# Altium schematic sheet Shoot-Me-Bot.SchDoc
size 863 x 558 mm
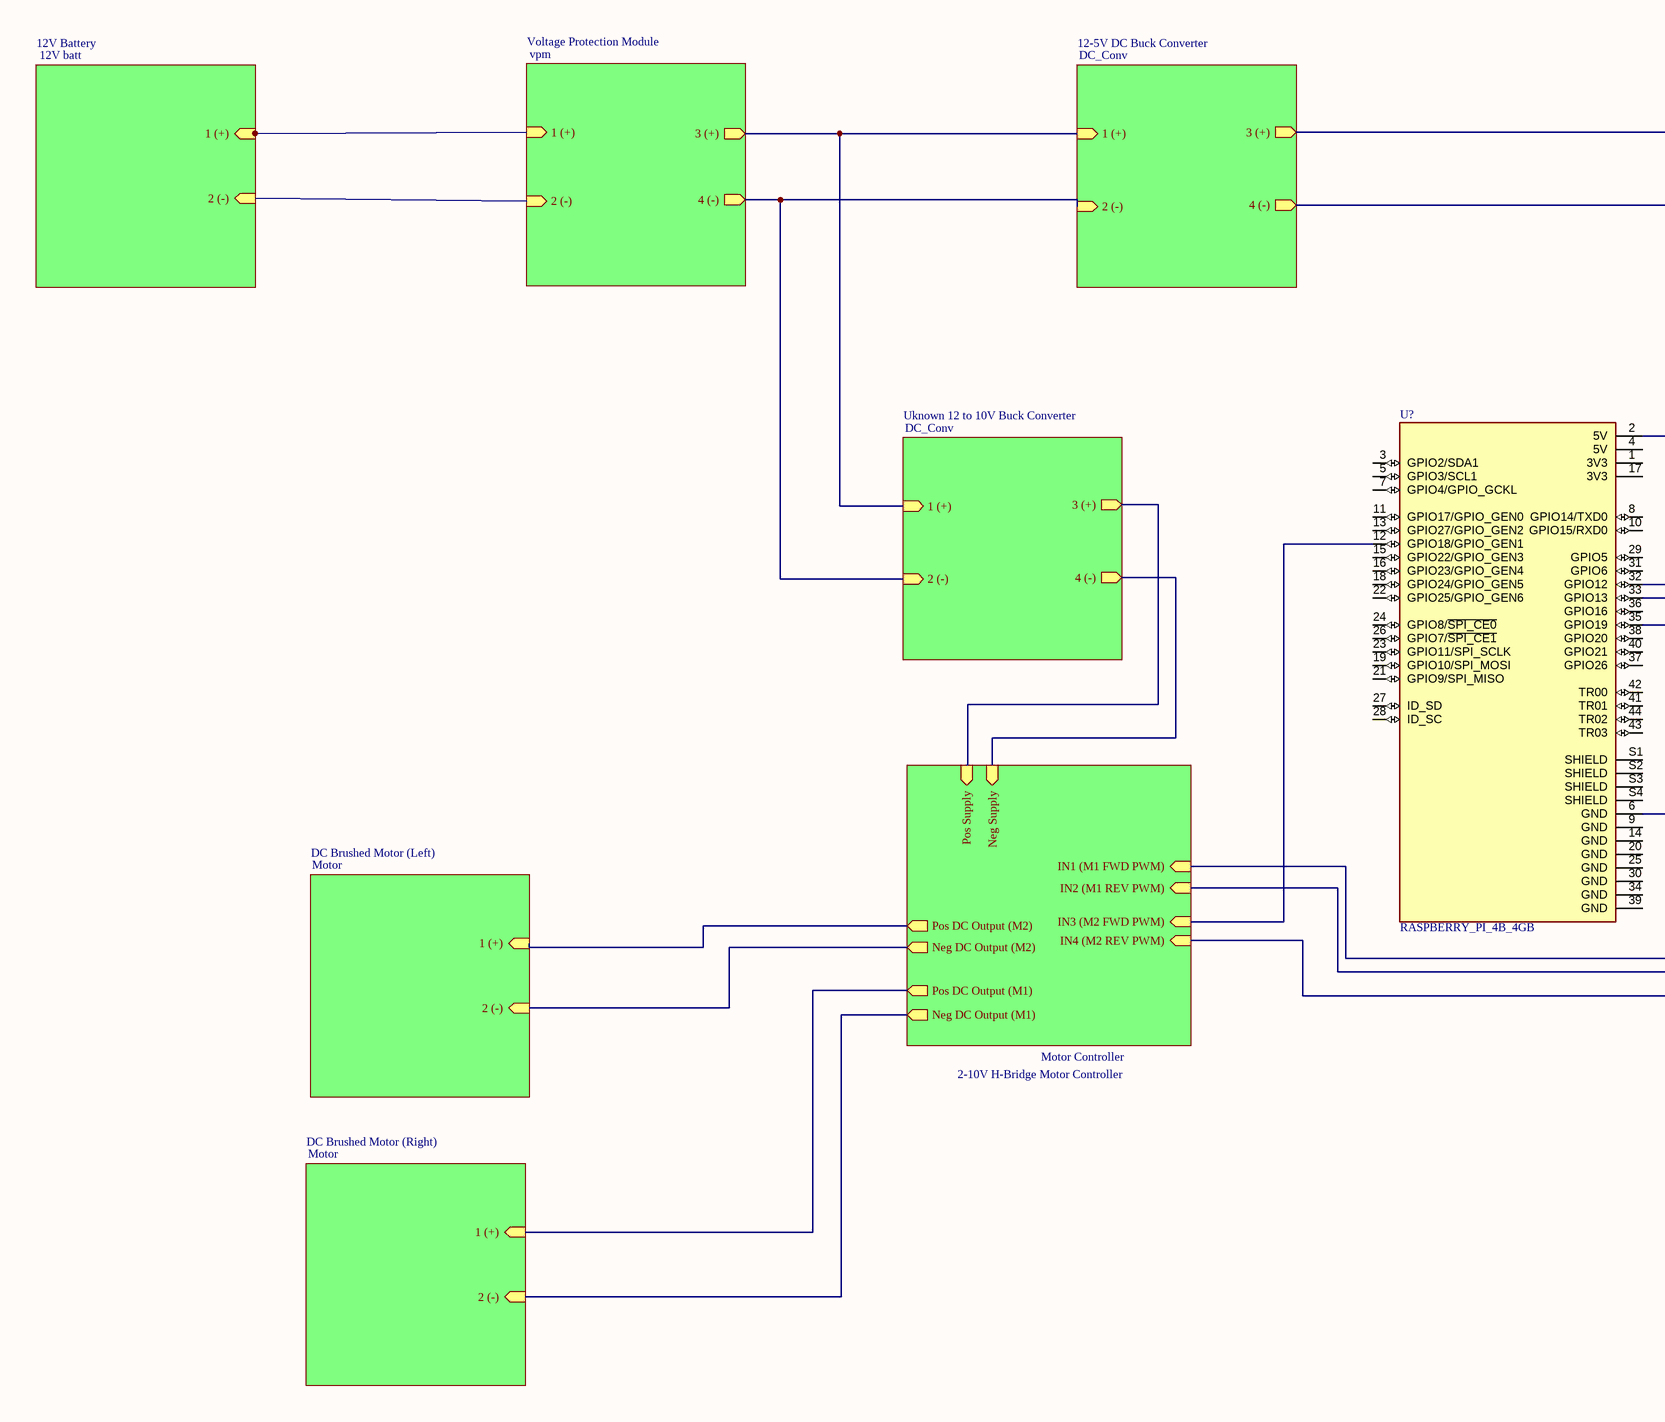
[diagram p0: Shoot-Me-Bot.SchDoc, left]
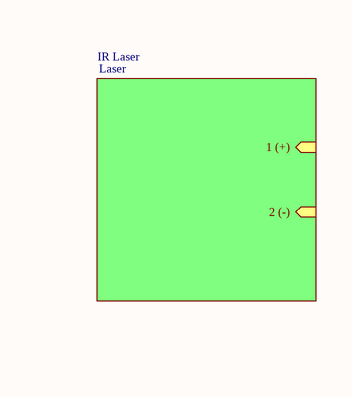
[diagram p1: Shoot-Me-Bot.SchDoc, right]

## Parts
U?  RASPBERRY_PI_4B_4GB  [MODULE_RASPBERRY_PI_4B_4GB]

## Sub-sheets
2-10V H-Bridge Motor Controller = Motor Controller: IN1 (M1 FWD PWM) (in), IN2 (M1 REV PWM) (in), IN3 (M2 FWD PWM) (in), IN4 (M2 REV PWM) (in), Pos DC Output (M1) (out), Neg DC Output (M1) (out), Pos DC Output (M2) (out), Neg DC Output (M2) (out), Pos Supply (in), Neg Supply (in)
12-5V DC Buck Converter = DC_Conv: 2 (-) (in), 1 (+) (in), 3 (+) (out), 4 (-) (out)
12V Battery = 12V batt: 2 (-) (in), 1 (+) (in)
DC Brushed Motor (Left) = Motor: 2 (-) (in), 1 (+) (in)
DC Brushed Motor (Right) = Motor: 2 (-) (in), 1 (+) (in)
IR Laser = Laser: 2 (-) (in), 1 (+) (in)
Uknown 12 to 10V Buck Converter = DC_Conv: 2 (-) (in), 1 (+) (in), 3 (+) (out), 4 (-) (out)
Voltage Protection Module = vpm: 2 (-) (in), 3 (+) (out), 1 (+) (in), 4 (-) (out)

## Nets
NetU?_2: U?.2(5V) ; sheet 12-5V DC Buck Converter/3 (+)
NetU?_6: U?.6(GND) ; sheet 12-5V DC Buck Converter/4 (-)
NetU?_12: U?.12(GPIO18/GPIO_GEN1) ; sheet 2-10V H-Bridge Motor Controller/IN3 (M2 FWD PWM)
NetU?_32: U?.32(GPIO12) ; sheet 2-10V H-Bridge Motor Controller/IN1 (M1 FWD PWM)
NetU?_33: U?.33(GPIO13) ; sheet 2-10V H-Bridge Motor Controller/IN2 (M1 REV PWM)
NetU?_35: U?.35(GPIO19) ; sheet 2-10V H-Bridge Motor Controller/IN4 (M2 REV PWM)
(unnamed): sheet Voltage Protection Module/2 (-), sheet 12V Battery/2 (-)
(unnamed): sheet Voltage Protection Module/3 (+), sheet 12-5V DC Buck Converter/1 (+), sheet Uknown 12 to 10V Buck Converter/1 (+)
(unnamed): sheet Voltage Protection Module/1 (+), sheet 12V Battery/1 (+)
(unnamed): sheet Voltage Protection Module/4 (-), sheet 12-5V DC Buck Converter/2 (-), sheet Uknown 12 to 10V Buck Converter/2 (-)
(unnamed): sheet DC Brushed Motor (Left)/2 (-), sheet 2-10V H-Bridge Motor Controller/Neg DC Output (M2)
(unnamed): sheet DC Brushed Motor (Left)/1 (+), sheet 2-10V H-Bridge Motor Controller/Pos DC Output (M2)
(unnamed): sheet DC Brushed Motor (Right)/2 (-), sheet 2-10V H-Bridge Motor Controller/Neg DC Output (M1)
(unnamed): sheet DC Brushed Motor (Right)/1 (+), sheet 2-10V H-Bridge Motor Controller/Pos DC Output (M1)
(unnamed): sheet 2-10V H-Bridge Motor Controller/Pos Supply, sheet Uknown 12 to 10V Buck Converter/3 (+)
(unnamed): sheet 2-10V H-Bridge Motor Controller/Neg Supply, sheet Uknown 12 to 10V Buck Converter/4 (-)

Not connected (* = marked no-connect by the designer): U? 1(3V3) 3(GPIO2/SDA1) 4(5V) 5(GPIO3/SCL1) 7(GPIO4/GPIO_GCKL) 8(GPIO14/TXD0) 9(GND) 10(GPIO15/RXD0) 11(GPIO17/GPIO_GEN0) 13(GPIO27/GPIO_GEN2) 14(GND) 15(GPIO22/GPIO_GEN3) 16(GPIO23/GPIO_GEN4) 17(3V3) 18(GPIO24/GPIO_GEN5) 19(GPIO10/SPI_MOSI) 20(GND) 21(GPIO9/SPI_MISO) 22(GPIO25/GPIO_GEN6) 23(GPIO11/SPI_SCLK) 24(GPIO8/~{SPI_CE0}) 25(GND) 26(GPIO7/~{SPI_CE1}) 27(ID_SD) 28(ID_SC) 29(GPIO5) 30(GND) 31(GPIO6) 34(GND) 36(GPIO16) 37(GPIO26) 38(GPIO20) 39(GND) 40(GPIO21) 41(TR01) 42(TR00) 43(TR03) 44(TR02) S1(SHIELD) S2(SHIELD) S3(SHIELD) S4(SHIELD)

## Notes on the sheet
- DWG. NO.
- REV.
- SHT.
- REVISION
- DESCRIPTION
- DATE
- APPROVED
- THIS DOCUMENT AND THE DATA DISCLOSED HEREIN OR HEREWITH IS THE PROPERTY OF ALTIUM LIMITED AND MAY BE FREELY DISTRIBUTED IN WHOLE. NO RIGHTS ARE RESERVED OR EXPRESS OR IMPLIED WARANTEE GIVEN.
- ENG:
- DSN:
- APPROVALS
- PROJECT
- DOCUMENT REVISION:
- DESIGN ITEM:
- CHK:
- BOM:
- REFERENCE DOCUMENTS
- PROJECT REVISION:
- TITLE
- FAB DWG:
- PCB DWG:
- ASSY DWG:
- SCALE:
- SIZE
- D
- CAGE CODE
- FILE NAME
- DWG NO.
- SHEET
- OF
- REV

## Library data of the parts
U? = RASPBERRY_PI_4B_4GB: BCM2711 Raspberry Pi 4 Model B 4GB - ARMÂ® CortexÂ®-A72 MPU Embedded Evaluation Board; MP: RASPBERRY PI 4B/4GB; Price: None; MF: Raspberry Pi; Check_prices: https://www.snapeda.com/parts/RASPBERRY%20PI%204B/4GB/Raspberry+Pi/view-part/?ref=eda; Value: *; Purchase-URL: https://pricing.snapeda.com/search/part/RASPBERRY PI 4B/4GB/?ref=eda; Availability: In Stock; SnapEDA_Link: https://www.snapeda.com/parts/RASPBERRY%20PI%204B/4GB/Raspberry+Pi/view-part/?ref=snap; Package: None